# Altium schematic sheet FCCPeripherals.SchDoc
size 297 x 209 mm
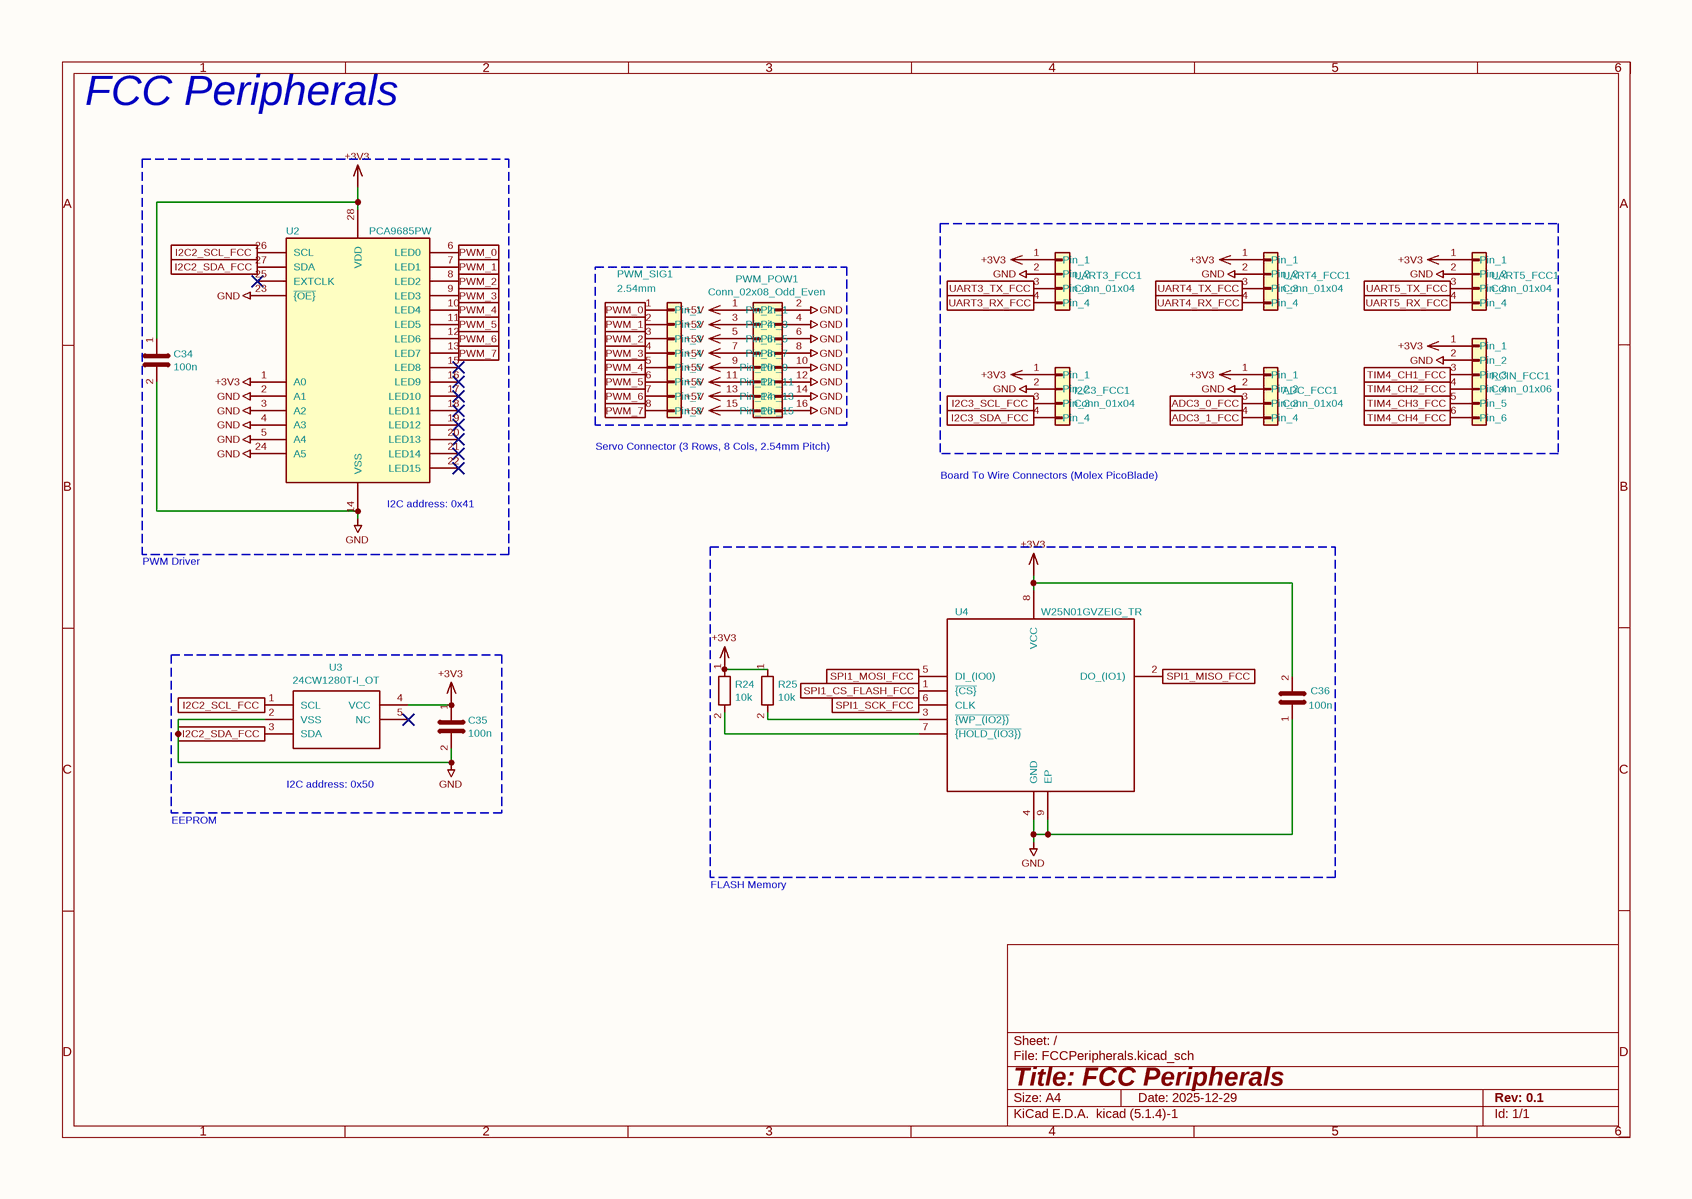
[diagram p0: FCCPeripherals.SchDoc]

## Parts
ADC_FCC1  Conn_01x04  [Molex_PicoBlade_53048-0410_1x04_P1.25mm_Horizontal]
C34  100n  [C_0402_1005Metric]
C35  100n  [C_0402_1005Metric]
C36  100n  [C_0402_1005Metric]
I2C3_FCC1  Conn_01x04  [Molex_PicoBlade_53048-0410_1x04_P1.25mm_Horizontal]
PWM_POW1  Conn_02x08_Odd_Even  [PinHeader_2x08_P2.54mm_Vertical]
PWM_SIG1  2.54mm  [PinHeader_1x08_P2.54mm_Vertical]
R24  10k  [R_0402_1005Metric]
R25  10k  [R_0402_1005Metric]
RCIN_FCC1  Conn_01x06  [Molex_PicoBlade_53048-0610_1x06_P1.25mm_Horizontal]
U2  PCA9685PW  [TSSOP-28_4.4x9.7mm_P0.65mm]
U3  24CW1280T-I_OT  [SOT95P280X145-5N]
U4  W25N01GVZEIG_TR  [SON127P800X600X80-9N-D]
UART3_FCC1  Conn_01x04  [Molex_PicoBlade_53048-0410_1x04_P1.25mm_Horizontal]
UART4_FCC1  Conn_01x04  [Molex_PicoBlade_53048-0410_1x04_P1.25mm_Horizontal]
UART5_FCC1  Conn_01x04  [Molex_PicoBlade_53048-0410_1x04_P1.25mm_Horizontal]

## Blocks framed on the sheet
I2C address: 0x41: C34 U2
I2C address: 0x50: C35 U3

## Ports
ADC3_0_FCC (in), ADC3_1_FCC (in), I2C2_SCL_FCC (in), I2C2_SDA_FCC (in), I2C3_SCL_FCC (in), I2C3_SDA_FCC (in), PWM_0 (in), PWM_1 (in), PWM_2 (in), PWM_3 (in), PWM_4 (in), PWM_5 (in), PWM_6 (in), PWM_7 (in), SPI1_CS_FLASH_FCC (in), SPI1_MISO_FCC (in), SPI1_MOSI_FCC (in), SPI1_SCK_FCC (in), TIM4_CH1_FCC (in), TIM4_CH2_FCC (in), TIM4_CH3_FCC (in), TIM4_CH4_FCC (in), UART3_RX_FCC (in), UART3_TX_FCC (in), UART4_RX_FCC (in), UART4_TX_FCC (in), UART5_RX_FCC (in), UART5_TX_FCC (in)

## Nets
+3V3: ADC_FCC1.1(Pin_1) C34.1 C35.1 C36.2 I2C3_FCC1.1(Pin_1) R24.1 R25.1 RCIN_FCC1.1(Pin_1) U2.1(A0) U2.28(VDD) U3.4(VCC) U4.8(VCC) UART3_FCC1.1(Pin_1) UART4_FCC1.1(Pin_1) UART5_FCC1.1(Pin_1)
+5V: PWM_POW1.1(Pin_1) PWM_POW1.3(Pin_3) PWM_POW1.5(Pin_5) PWM_POW1.7(Pin_7) PWM_POW1.9(Pin_9) PWM_POW1.11(Pin_11) PWM_POW1.13(Pin_13) PWM_POW1.15(Pin_15)
GND: ADC_FCC1.2(Pin_2) C34.2 C35.2 C36.1 I2C3_FCC1.2(Pin_2) PWM_POW1.2(Pin_2) PWM_POW1.4(Pin_4) PWM_POW1.6(Pin_6) PWM_POW1.8(Pin_8) PWM_POW1.10(Pin_10) PWM_POW1.12(Pin_12) PWM_POW1.14(Pin_14) PWM_POW1.16(Pin_16) RCIN_FCC1.2(Pin_2) U2.2(A1) U2.3(A2) U2.4(A3) U2.5(A4) U2.14(VSS) U2.23(~{{OE}}) U2.24(A5) U2.27(SDA) U3.2(VSS) U3.3(SDA) U4.4(GND) U4.9(EP) UART3_FCC1.2(Pin_2) UART4_FCC1.2(Pin_2) UART5_FCC1.2(Pin_2) ; port I2C2_SDA_FCC
ADC3_0_FCC: ADC_FCC1.3(Pin_3) ; port ADC3_0_FCC
ADC3_1_FCC: ADC_FCC1.4(Pin_4) ; port ADC3_1_FCC
I2C2_SCL_FCC: U2.26(SCL) U3.1(SCL) ; port I2C2_SCL_FCC
I2C3_SCL_FCC: I2C3_FCC1.3(Pin_3) ; port I2C3_SCL_FCC
I2C3_SDA_FCC: I2C3_FCC1.4(Pin_4) ; port I2C3_SDA_FCC
PWM_0: PWM_SIG1.1(Pin_1) U2.6(LED0) ; port PWM_0
PWM_1: PWM_SIG1.2(Pin_2) U2.7(LED1) ; port PWM_1
PWM_2: PWM_SIG1.3(Pin_3) U2.8(LED2) ; port PWM_2
PWM_3: PWM_SIG1.4(Pin_4) U2.9(LED3) ; port PWM_3
PWM_4: PWM_SIG1.5(Pin_5) U2.10(LED4) ; port PWM_4
PWM_5: PWM_SIG1.6(Pin_6) U2.11(LED5) ; port PWM_5
PWM_6: PWM_SIG1.7(Pin_7) U2.12(LED6) ; port PWM_6
PWM_7: PWM_SIG1.8(Pin_8) U2.13(LED7) ; port PWM_7
SPI1_CS_FLASH_FCC: U4.1(~{{CS}}) ; port SPI1_CS_FLASH_FCC
SPI1_MISO_FCC: U4.2(DO_(IO1)) ; port SPI1_MISO_FCC
SPI1_MOSI_FCC: U4.5(DI_(IO0)) ; port SPI1_MOSI_FCC
SPI1_SCK_FCC: U4.6(CLK) ; port SPI1_SCK_FCC
TIM4_CH1_FCC: RCIN_FCC1.3(Pin_3) ; port TIM4_CH1_FCC
TIM4_CH2_FCC: RCIN_FCC1.4(Pin_4) ; port TIM4_CH2_FCC
TIM4_CH3_FCC: RCIN_FCC1.5(Pin_5) ; port TIM4_CH3_FCC
TIM4_CH4_FCC: RCIN_FCC1.6(Pin_6) ; port TIM4_CH4_FCC
UART3_RX_FCC: UART3_FCC1.4(Pin_4) ; port UART3_RX_FCC
UART3_TX_FCC: UART3_FCC1.3(Pin_3) ; port UART3_TX_FCC
UART4_RX_FCC: UART4_FCC1.4(Pin_4) ; port UART4_RX_FCC
UART4_TX_FCC: UART4_FCC1.3(Pin_3) ; port UART4_TX_FCC
UART5_RX_FCC: UART5_FCC1.4(Pin_4) ; port UART5_RX_FCC
UART5_TX_FCC: UART5_FCC1.3(Pin_3) ; port UART5_TX_FCC
NetR24_2: R24.2 U4.7(~{{HOLD_(IO3})})
NetR25_2: R25.2 U4.3(~{{WP_(IO2})})

Not connected (* = marked no-connect by the designer): U2 15(LED8)* 16(LED9)* 17(LED10)* 18(LED11)* 19(LED12)* 20(LED13)* 21(LED14)* 22(LED15)* 25(EXTCLK)*; U3 5(NC)*

## Notes on the sheet
- FCC Peripherals
- Servo Connector
  (3 Rows, 8 Cols, 2.54mm Pitch)
- (near I2C3_FCC1) Board To Wire Connectors
  (Molex PicoBlade)
- PWM Driver
- EEPROM
- FLASH Memory
- 1
- 2
- 3
- 4
- 5
- 6
- A
- B
- C
- D
- Title: FCC Peripherals
- File: FCCPeripherals.kicad_sch
- Sheet: /
- KiCad E.D.A.  kicad (5.1.4)-1
- Size: A4
- Date: 2025-12-29
- Rev: 0.1
- Id: 1/1

## Library data of the parts
C34-C36 = C: Value: 100n; Footprint: Capacitor_SMD:C_0402_1005Metric
PWM_SIG1 = Conn_01x08: Value: 2.54mm; Footprint: Connector_PinHeader_2.54mm:PinHeader_1x08_P2.54mm_Vertical
R24 R25 = R: Value: 10k; Footprint: Resistor_SMD:R_0402_1005Metric
U3 = 24CW1280T-I_OT: Manufacturer_Name: Microchip; Manufacturer_Part_Number: 24CW1280T-I/OT; Description: MICROCHIP - 24CW1280T-I/OT - EEPROM, 128KBIT, -40 TO 85DEG C; Height: 1.45; Mouser Part Number: 579-24CW1280T-I/OT; Mouser Price/Stock: https://www.mouser.com/Search/Refine.aspx?Keyword=579-24CW1280T-I%2FOT; RS Part Number: 1871851; RS Price/Stock: http://uk.rs-online.com/web/p/products/1871851; Value: 24CW1280T-I_OT; Footprint: 24CW1280T-I_OT:SOT95P280X145-5N
U4 = W25N01GVZEIG_TR: Manufacturer_Name: Winbond; Manufacturer_Part_Number: W25N01GVZEIG TR; Description: IC FLASH 1GBIT 104MHZ 8WSON; Height: 0.8; Mouser Part Number: 454-W25N01GVZEIGTR; Mouser Price/Stock: https://www.mouser.com/Search/Refine.aspx?Keyword=454-W25N01GVZEIGTR; Value: W25N01GVZEIG_TR; Footprint: W25N01GVZEIG_TR:SON127P800X600X80-9N-D
ADC_FCC1 I2C3_FCC1 UART3_FCC1 UART4_FCC1 UART5_FCC1 = Conn_01x04: Value: Conn_01x04; Footprint: Connector_Molex:Molex_PicoBlade_53048-0410_1x04_P1.25mm_Horizontal
PWM_POW1 = Conn_02x08_Odd_Even: Value: Conn_02x08_Odd_Even; Footprint: Connector_PinHeader_2.54mm:PinHeader_2x08_P2.54mm_Vertical
RCIN_FCC1 = Conn_01x06: Value: Conn_01x06; Footprint: Connector_Molex:Molex_PicoBlade_53048-0610_1x06_P1.25mm_Horizontal
U2 = PCA9685PW: Value: PCA9685PW; Footprint: Package_SO:TSSOP-28_4.4x9.7mm_P0.65mm